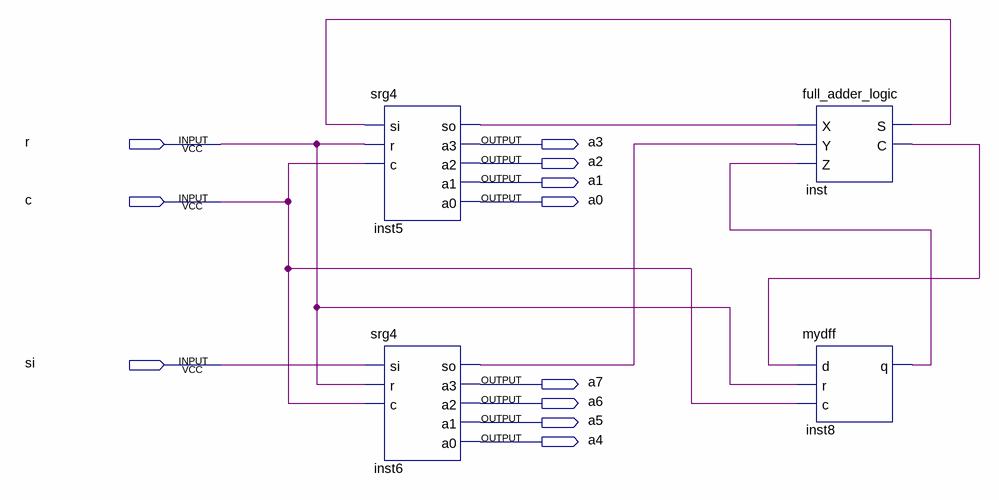
[diagram p0: schematic sheet]
// Quartus schematic serial_adder.bdf as structural Verilog: 4 symbols, 11 pins
module serial_adder (
  input  r,
  input  c,
  input  si,
  output a3,
  output a2,
  output a1,
  output a0,
  output a7,
  output a6,
  output a5,
  output a4
);

  wire inst5_so, inst6_so, inst8_q, inst_c, inst_s;

  srg4 inst5 (.si(inst_s), .r(r), .c(c), .so(inst5_so), .a3(a3), .a2(a2), .a1(a1), .a0(a0));
  srg4 inst6 (.si(si), .r(r), .c(c), .so(inst6_so), .a3(a7), .a2(a6), .a1(a5), .a0(a4));
  full_adder_logic inst (.X(inst5_so), .Y(inst6_so), .Z(inst8_q), .S(inst_s), .C(inst_c));
  mydff inst8 (.d(inst_c), .r(r), .c(c), .q(inst8_q));
endmodule
